# Altium schematic sheet RF liner.SchDoc
size A2
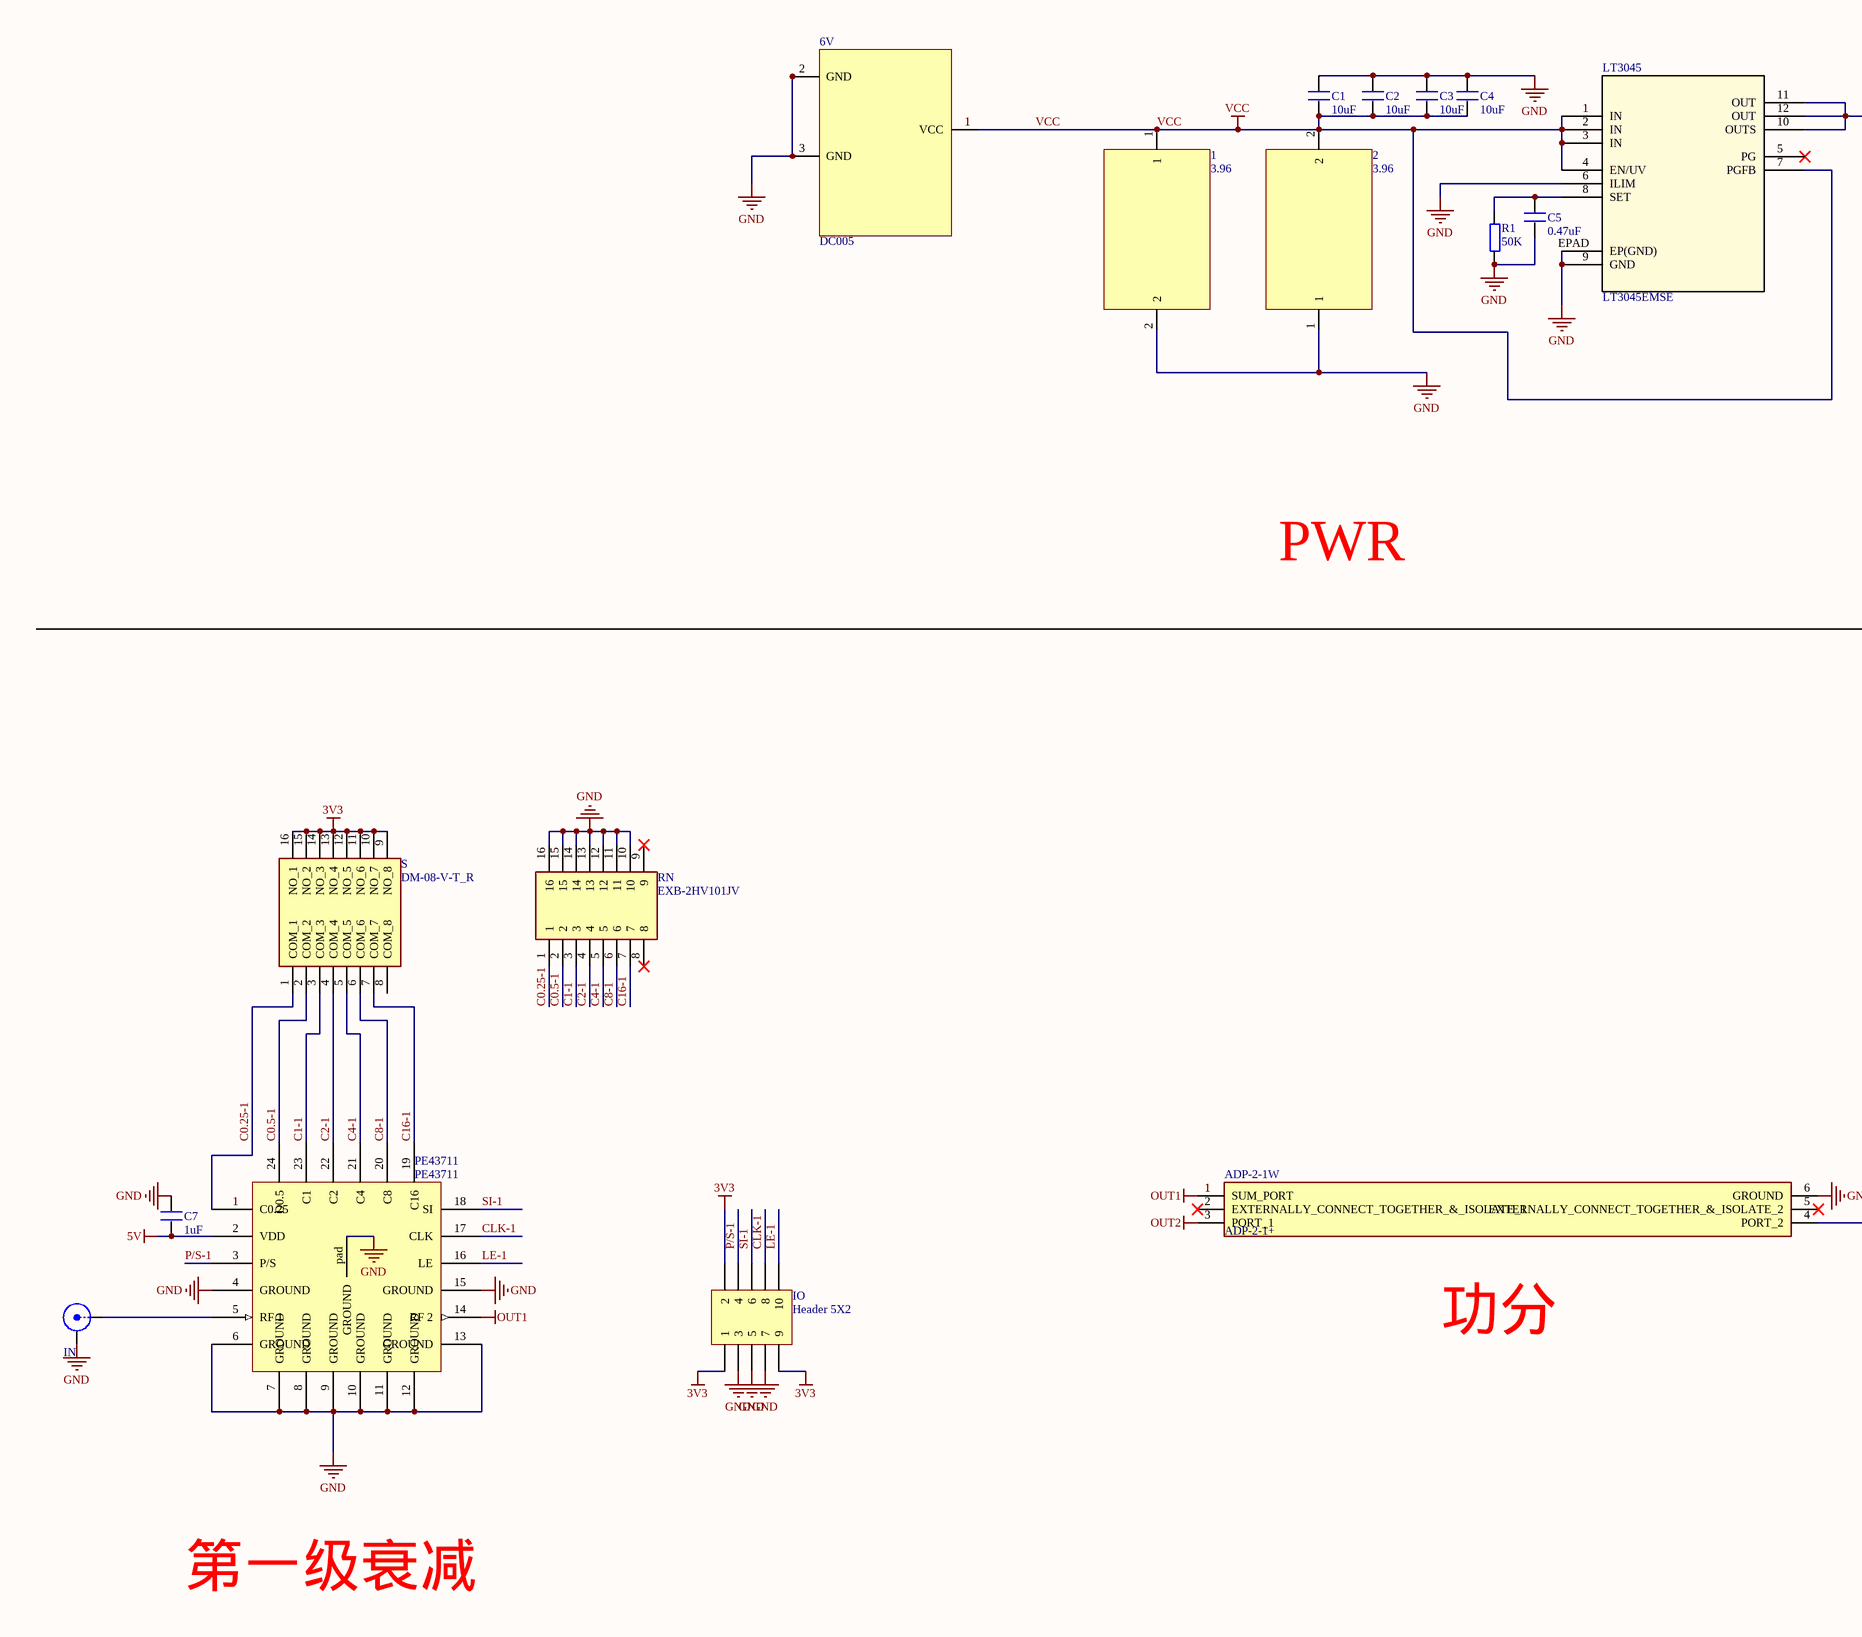
[diagram p0: RF liner.SchDoc, left]
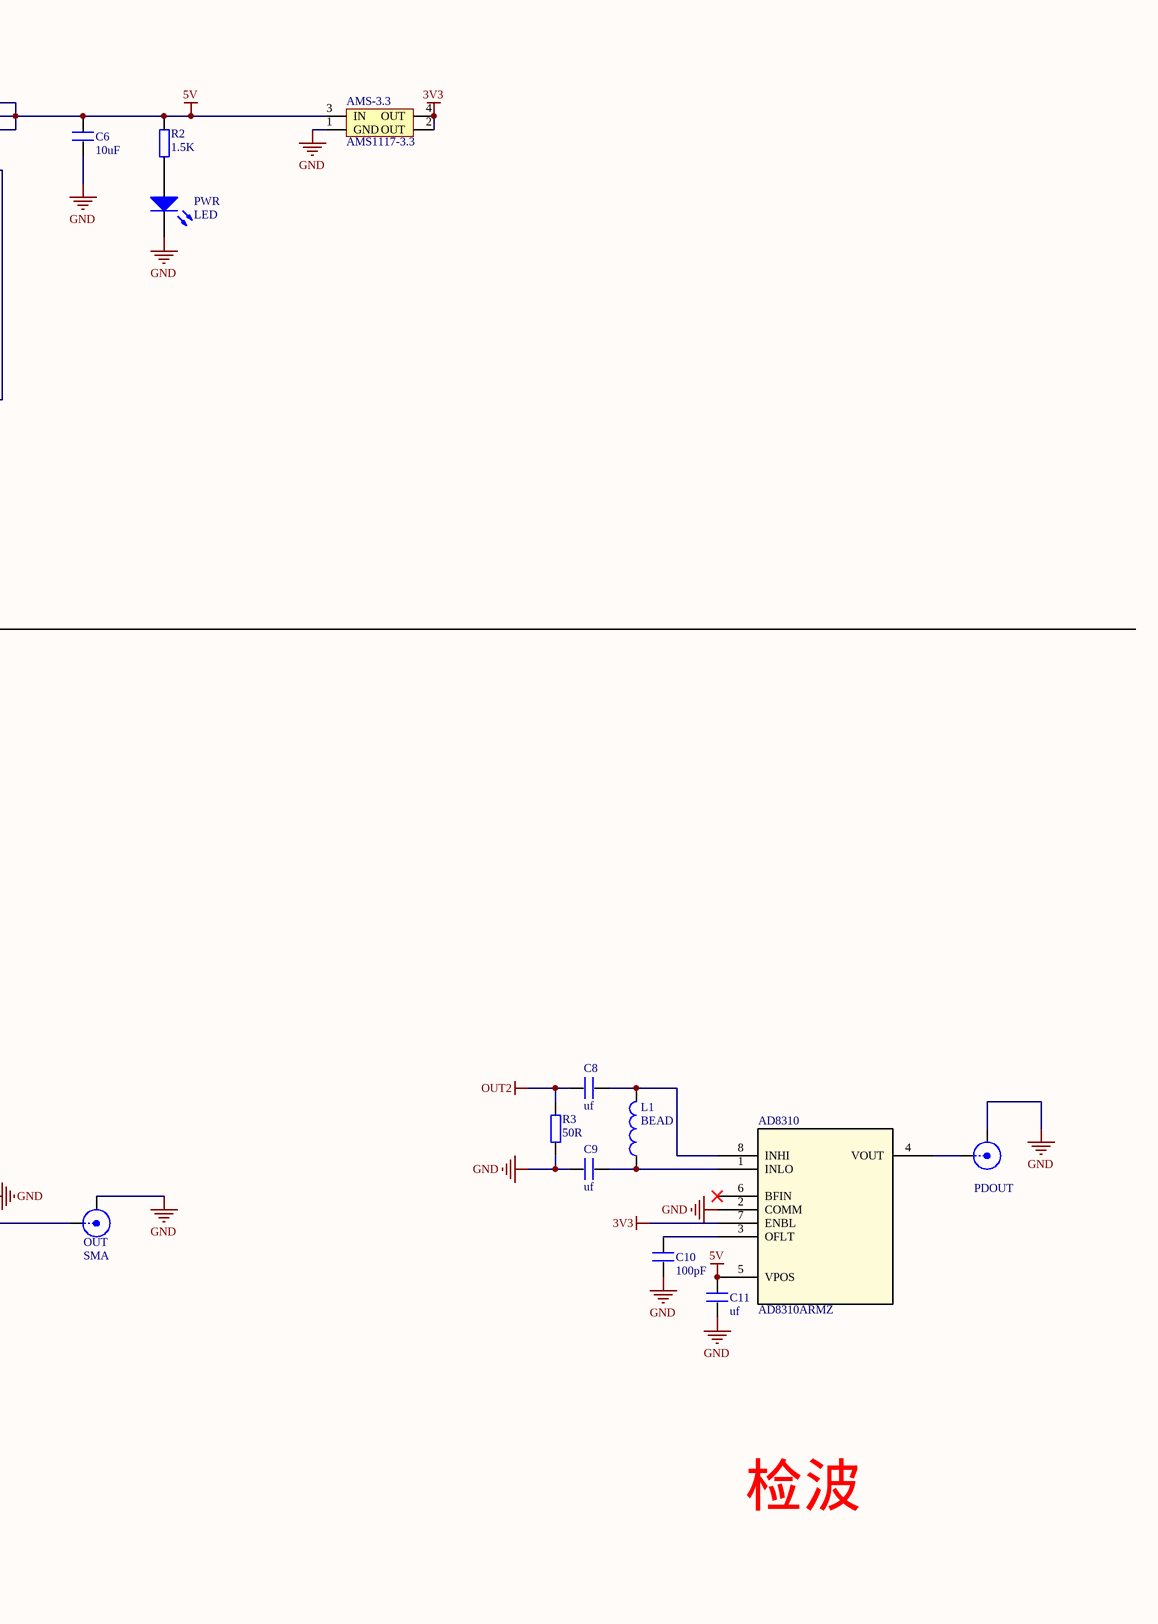
[diagram p1: RF liner.SchDoc, right]

## Parts
1  3.96  [3.96]
2  3.96  [3.96]
6V  DC005  [DC10B]
AD8310  AD8310ARMZ  [RM_8_ADI]
ADP-2-1W  ADP-2-1+  [ADP21]
AMS-3.3  AMS1117-3.3  [AMS1117]
C1  10uF  [CAP 1.5*4*8]
C2  10uF  [CAP 1.5*4*8]
C3  10uF  [0603C]
C4  10uF  [0603C]
C5  0.47uF  [0402]
C6  10uF  [0402]
C7  1uF  [0402]
C8  uf  [0603C]
C9  uf  [0603C]
C10  100pF  [0603C]
C11  uf  [0603C]
IN  SMA  [SMA]  (value not drawn)
IO  Header 5X2  [HDR2X5]
L1  BEAD  [0603L]
LT3045  LT3045EMSE  [MSOP12-MSE-RevG_ADI]
OUT  SMA  [SMA]
PDOUT  SMA  [SMA]  (value not drawn)
PE43711  PE43711  [PE43711]
PWR  LED  [SMDLED]
R1  50K  [0402]
R2  1.5K  [0603R]
R3  50R  [0603R]
RN  EXB-2HV101JV  [EXB2HV101JV]
S  DM-08-V-T_R  [DM08VTR]

## Nets
3V3: AD8310.7(ENBL) AMS-3.3.2(OUT) AMS-3.3.4(OUT) IO.1 IO.2 IO.9 S.9(NO_8) S.10(NO_7) S.11(NO_6) S.12(NO_5) S.13(NO_4) S.14(NO_3) S.15(NO_2) S.16(NO_1)
5V: AD8310.5(VPOS) AMS-3.3.3(IN) C6.2 C7.1 C11.2 LT3045.10(OUTS) LT3045.11(OUT) LT3045.12(OUT) PE43711.2(VDD) R2.2
GND: 1.2 2.1 6V.2(GND) 6V.3(GND) AD8310.2(COMM) ADP-2-1W.6(GROUND) AMS-3.3.1(GND) C1.2 C2.2 C3.2 C4.2 C5.2 C6.1 C7.2 C9.1 C10.1 C11.1 IN.2(Y) IO.3 IO.5 IO.7 LT3045.6(ILIM) LT3045.9(GND) LT3045.EPAD(EP(GND)) OUT.2(Y) PDOUT.2(Y) PE43711.4(GROUND) PE43711.6(GROUND) PE43711.7(GROUND) PE43711.8(GROUND) PE43711.9(GROUND) PE43711.10(GROUND) PE43711.11(GROUND) PE43711.12(GROUND) PE43711.13(GROUND) PE43711.15(GROUND) PE43711.pad(GROUND) PWR.2(K) R1.1 R3.1 RN.10 RN.11 RN.12 RN.13 RN.14 RN.15 RN.16
OUT1: ADP-2-1W.1(SUM_PORT) PE43711.14(RF_2)
OUT2: ADP-2-1W.3(PORT_1) C8.1 R3.2
VCC: 1.1 2.2 6V.1(VCC) C1.1 C2.1 C3.1 C4.1 LT3045.1(IN) LT3045.2(IN) LT3045.3(IN) LT3045.4(EN/UV) LT3045.7(PGFB)
C0.5-1: PE43711.24(D0.5) RN.2 S.2(COM_2)
C0.25-1: PE43711.1(C0.25) RN.1 S.1(COM_1)
C1-1: PE43711.23(C1) RN.3 S.3(COM_3)
C2-1: PE43711.22(C2) RN.4 S.4(COM_4)
C4-1: PE43711.21(C4) RN.5 S.5(COM_5)
C8-1: PE43711.20(C8) RN.6 S.6(COM_6)
C16-1: PE43711.19(C16) RN.7 S.7(COM_7)
CLK-1: IO.8 PE43711.17(CLK)
LE-1: IO.10 PE43711.16(LE)
P/S-1: IO.4 PE43711.3(P/S)
SI-1: IO.6 PE43711.18(SI)
NetAD8310_1: AD8310.1(INLO) C9.2 L1.1
NetAD8310_3: AD8310.3(OFLT) C10.2
NetAD8310_4: AD8310.4(VOUT) PDOUT.1(X)
NetAD8310_8: AD8310.8(INHI) C8.2 L1.2
NetADP-2-1W_4: ADP-2-1W.4(PORT_2) OUT.1(X)
NetC5_1: C5.1 LT3045.8(SET) R1.2
NetIN_1: IN.1(X) PE43711.5(RF_1)
NetPWR_1: PWR.1(A) R2.1

Not connected (* = marked no-connect by the designer): AD8310 6(BFIN)*; ADP-2-1W 2(EXTERNALLY_CONNECT_TOGETHER_&_ISOLATE_1)* 5(EXTERNALLY_CONNECT_TOGETHER_&_ISOLATE_2)*; LT3045 5(PG)*; RN 8* 9*; S 8(COM_8)

## Notes on the sheet
- PWR
- 功分
- 检波
- 第一级衰减

## Library data of the parts
AD8310 = AD8310ARMZ: No Description Available; SourceLibrary: Analog_2012-01-01_5; Built_By: EMA_UL_Team; Vendor: Analog Devices Inc; Manufacturer_Part_Number: AD8310ARMZ; Copyright: Copyright (C) 2018 Accelerated Designs. All rights reserved; RefDes: RefDes; Type: DEV
ADP-2-1W = ADP-2-1+: Integrated Circuit; Manufacturer_Name: Mini-Circuits; Datasheet Link: https://componentsearchengine.com/Datasheets/1/ADP-2-1+.pdf; Height: 4.11mm; Manufacturer_Part_Number: ADP-2-1+; Mouser Part Number: 139-ADP-2-1; Mouser Price/Stock: https://www.mouser.co.uk/ProductDetail/Mini-Circuits/ADP-2-1%2b?qs=xZ%2FP%252Ba9zWqY2KuyLpf%2FxaQ%3D%3D
AMS-3.3 = AMS1117
C1-C11 = C: Capacitor
IN OUT PDOUT = SMA: SMA Connector
IO = Header 5X2: Header, 5-Pin, Dual row; LatestRevisionDate: 17-Jul-2002; LatestRevisionNote: Re-released for DXP Platform.; Publisher: Altium Limited
L1 = Inductor: Value: 100uH; Published: 8-Jun-2000; Revision: July-2002: Re-released for DXP Platform.; Publisher: Altium Limited
LT3045 = LT3045EMSE: No Description Available; SourceLibrary: Analog_Devices_Inc_2020-09-15; Built_By: SunStream; Vendor: Analog Devices Inc; Copyright: Copyright (C) 2018 Accelerated Designs. All rights reserved; Manufacturer_Part_Number: LT3045EMSE; RefDes: RefDes; Type: DEV
PWR = LED: Typical RED, GREEN, YELLOW, AMBER GaAs LED; Published: 8-Jun-2000; LatestRevisionDate: 17-Jul-2002; LatestRevisionNote: Re-released for DXP Platform.; PackageDocument: Feb-2002; PackageReference: 3.2X1.6X1.1; Publisher: Altium Limited
R1-R3 = Resistor
RN = EXB-2HV101JV: Resistor Network; Manufacturer_Name: Panasonic; Datasheet Link: https://industrial.panasonic.com/cdbs/www-data/pdf/AOC0000/AOC0000C14.pdf; Height: 0.55mm; Manufacturer_Part_Number: EXB-2HV101JV; Mouser Part Number: 667-EXB-2HV101JV; Mouser Price/Stock: https://www.mouser.co.uk/ProductDetail/Panasonic/EXB-2HV101JV?qs=oE3VwAv%2FYtkI4Sp%252Bk267NQ%3D%3D; Arrow Part Number: EXB-2HV101JV; Arrow Price/Stock: https://www.arrow.com/en/products/exb-2hv101jv/panasonic
S = DM-08-V-T_R: Switch; Manufacturer_Name: Diptronics; Manufacturer_Part_Number: DM-08-V-T/R; Datasheet Link: http://www.dip.com.tw/en/en-product-information/en-switch002/item/download/2412_2ffa0571076f7652f42c65d9d72a148c; Height: 3.15mm